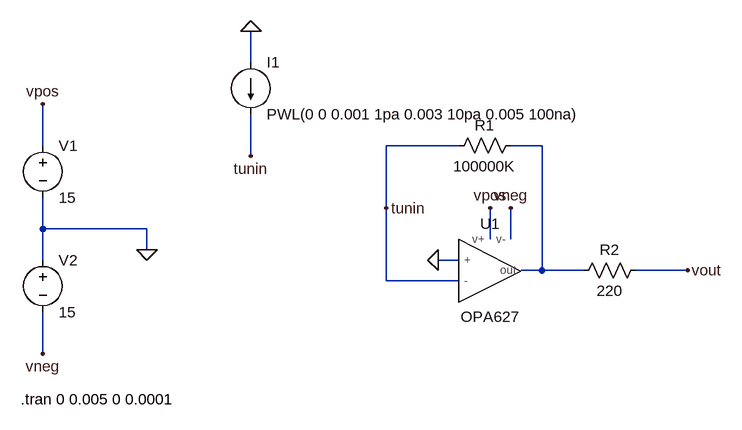
[diagram p0: schematic TunnelingAmp.asc]
TunnelingAmp.asc, the LTspice schematic file:
Version 4
SHEET 1 880 680
WIRE -176 -144 -176 -192
WIRE -496 -16 -496 -80
WIRE 144 -16 32 -16
WIRE 272 -16 224 -16
WIRE -176 0 -176 -64
WIRE 32 80 32 -16
WIRE -496 112 -496 64
WIRE -336 112 -496 112
WIRE 192 128 192 80
WIRE 224 128 224 80
WIRE -336 144 -336 112
WIRE -496 160 -496 112
WIRE 144 160 112 160
WIRE 272 176 272 -16
WIRE 272 176 240 176
WIRE 336 176 272 176
WIRE 496 176 416 176
WIRE 32 192 32 80
WIRE 144 192 32 192
WIRE -496 304 -496 240
FLAG -336 144 0
FLAG -496 -80 vpos
FLAG -496 304 vneg
FLAG 112 160 0
FLAG 224 80 vneg
FLAG 192 80 vpos
FLAG 496 176 vout
FLAG 32 80 tunin
FLAG -176 -192 0
FLAG -176 0 tunin
SYMBOL AutoGenerated\\OPA627 192 176 R0
SYMATTR InstName U1
SYMBOL voltage -496 -32 R0
WINDOW 123 0 0 Left 2
WINDOW 39 0 0 Left 2
SYMATTR InstName V1
SYMATTR Value 15
SYMBOL voltage -496 144 R0
WINDOW 123 0 0 Left 2
WINDOW 39 0 0 Left 2
SYMATTR InstName V2
SYMATTR Value 15
SYMBOL res 240 -32 R90
WINDOW 0 0 56 VBottom 2
WINDOW 3 32 56 VTop 2
SYMATTR InstName R1
SYMATTR Value 100000K
SYMBOL res 432 160 R90
WINDOW 0 0 56 VBottom 2
WINDOW 3 32 56 VTop 2
SYMATTR InstName R2
SYMATTR Value 220
SYMBOL current -176 -144 R0
WINDOW 123 0 0 Left 2
WINDOW 39 0 0 Left 2
SYMATTR InstName I1
SYMATTR Value PWL(0 0 0.001 1pa 0.003 10pa 0.005 100na)
TEXT -530 374 Left 2 !.tran 0 0.005 0 0.0001

The netlist it stands for:
* TunnelingAmp.asc
XU1 0 tunin vpos vneg N001 OPA627  ; pins + - v+ v- out
V1 vpos 0 15
V2 0 vneg 15
R1 N001 tunin 100000K
R2 vout N001 220
I1 0 tunin PWL(0 0 0.001 1pa 0.003 10pa 0.005 100na)
.tran 0 0.005 0 0.0001
.lib C:\Users\Reuben Carter\Desktop\STMRepo\Electronic\Designs\TunnelingAmp\Simulation\OPA627.MOD
.backanno
.end